# EAGLE schematic ASL1101 (EAGLE 6.2)
DATABASE: ./../../../../../Components/TinyCircuits_Part_Database.txt
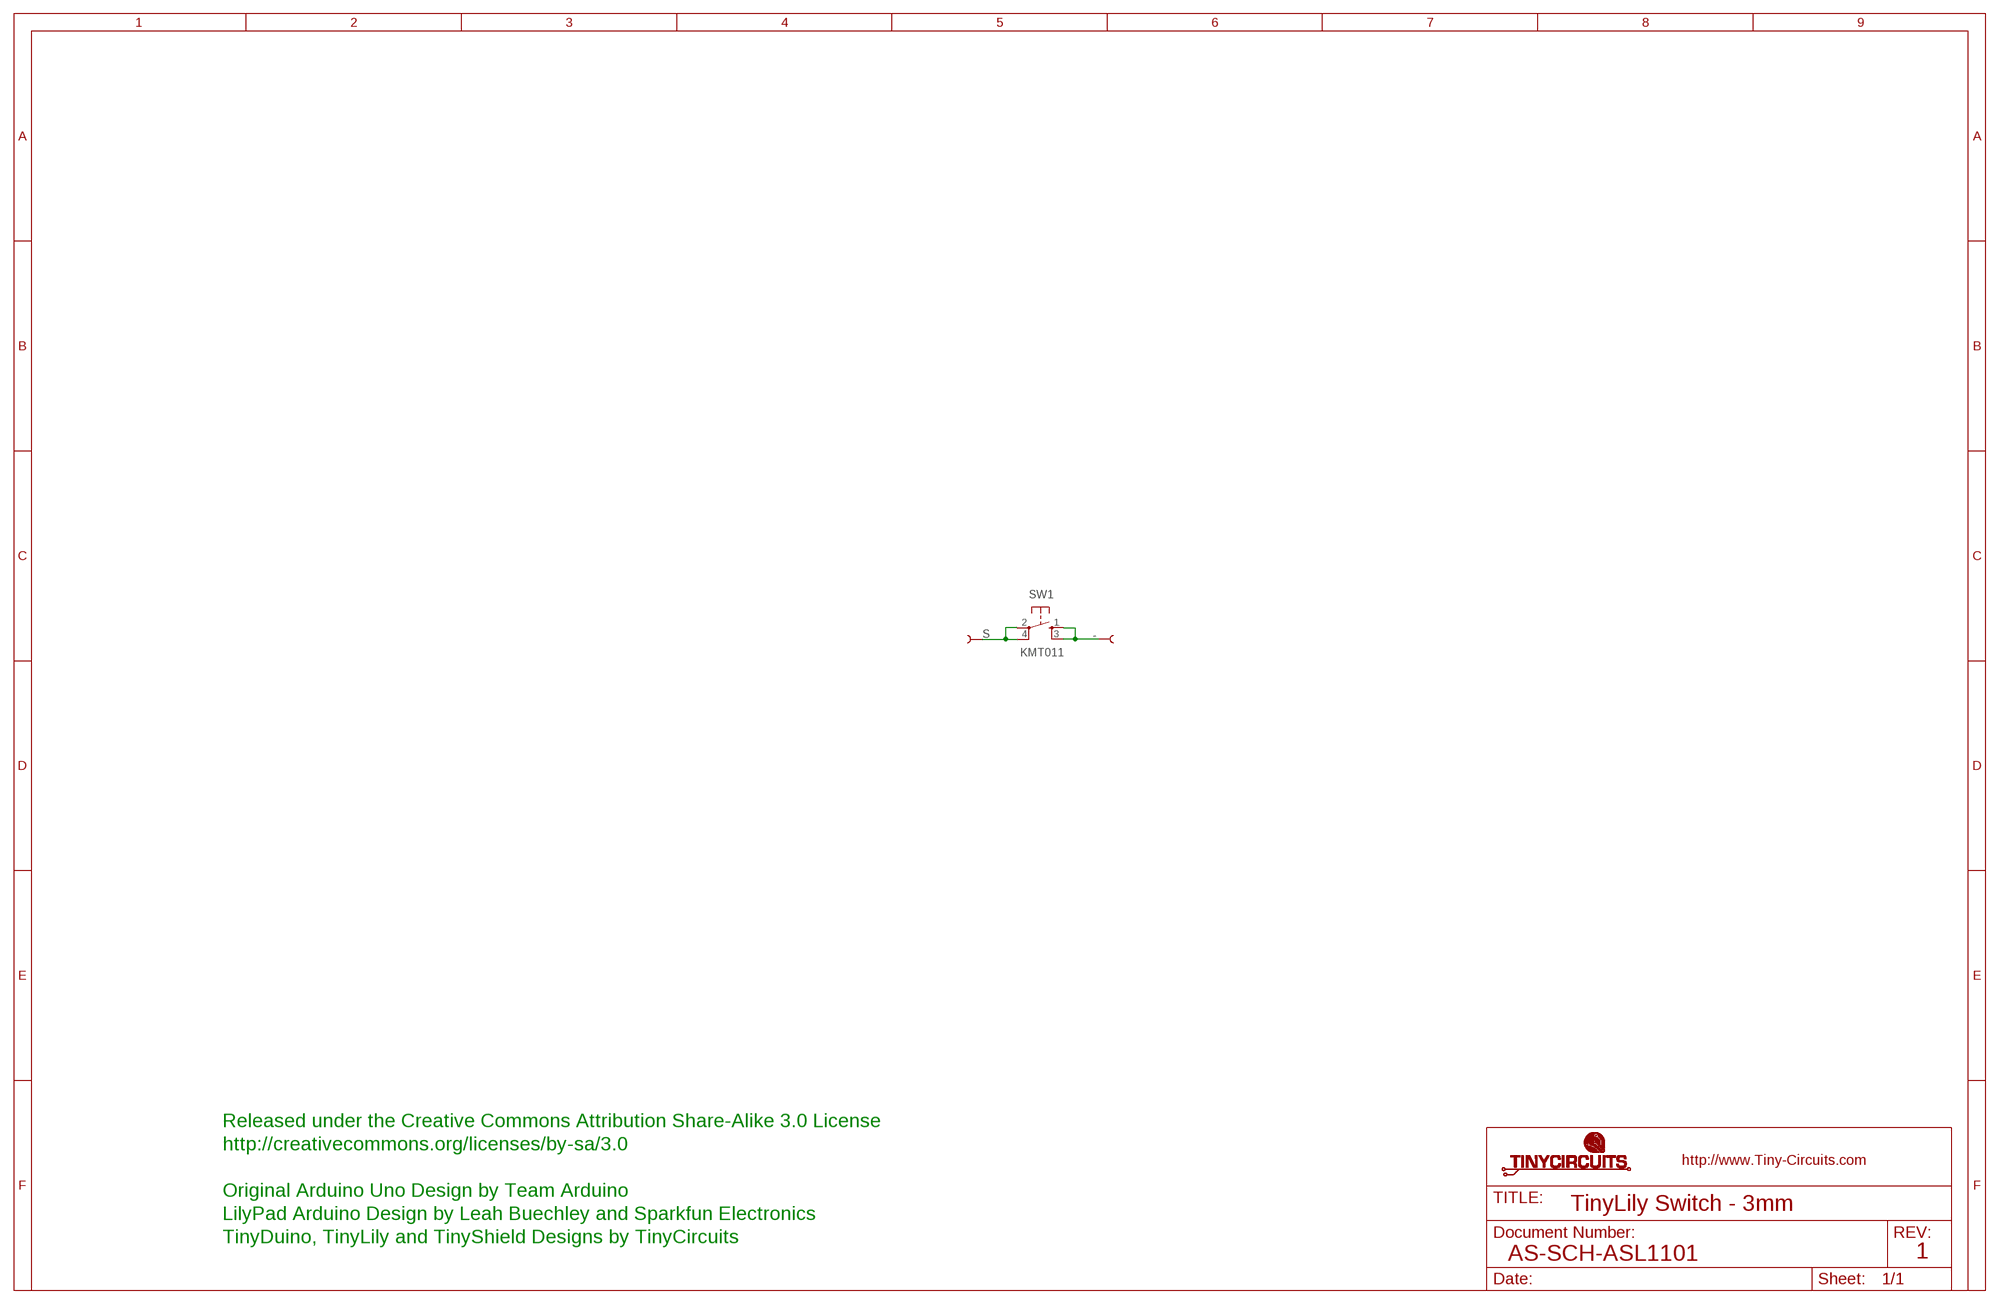
[diagram p0: schematic, sheet 1]

## Parts
SW1  KMT011  AS-ITM-00041  [KMT011]
U$1  SEWTABTH_1206  [SEWTAP_TH_1206]
U$7  SEWTABTH_1206  [SEWTAP_TH_1206]

## Nets
-: SW1.1 SW1.3 U$1.1
S: SW1.2 SW1.4 U$7.1

## Notes on the sheet
- Released under the Creative Commons Attribution Share-Alike 3.0 License
- http://creativecommons.org/licenses/by-sa/3.0
- Original Arduino Uno Design by Team Arduino
- TinyLily Switch - 3mm
- LilyPad Arduino Design by Leah Buechley and Sparkfun Electronics
- TinyDuino, TinyLily and TinyShield Designs by TinyCircuits
- AS-SCH-ASL1101 | 1

## Library data of the parts
SW1 = tinycircuits:AS-ITM-00041: SWITCH TACTILE SPST-NO 0.05A 32V; PARTNO: AS-ITM-00041
U$1 U$7 = tinycircuits:SEWTAB: TinyLily Sew Tab; BOM: EXCLUDE; DNP: T